# EAGLE design schematic3 (EAGLE 9.3.0)
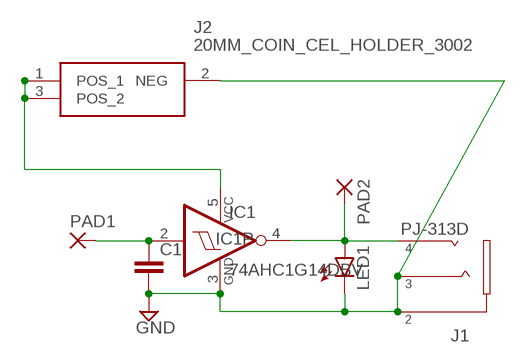
[diagram p0: schematic, sheet 1]

## Parts
C1  C-EUC0805  [C0805]
IC1  74AHC1G14DBV  [SOT23-5]
J1  PJ-313D  [PJ-313D]
J2  20MM_COIN_CEL_HOLDER_3002  [SMT_CELL_HOLDER]
LED1  LEDCHIP-LED0805  [CHIP-LED0805]
PAD1  SMD5  [SMD2,54-5,08]
PAD2  SMD5  [SMD2,54-5,08]

## Nets
GND: C1.2 IC1.3(GND) J1.2_1 J1.2_2 J1.3_1 J1.3_2 J2.2(NEG) LED1.C
N$1: C1.1 IC1.2(I) PAD1.1(P)
N$2: IC1.5(VCC) J2.1(POS_1) J2.3(POS_2)
N$3: IC1.4(O) J1.4_1 J1.4_2 LED1.A PAD2.1(P)

## Library data of the parts
C1 = rcl:C-EU: CAPACITOR, European symbol; SPICEPREFIX: C
IC1 = 74xx-little-us:74*1G14: Single Schmitt-Trigger Inverter Gate
J1 = jacks chinese:PJ-313: 3.5mm jack description Brover Geldrop MK
J2 = BatteryHolders:20MM_COIN_CEL_HOLDER_3002: SMT Holder for 20mm Cell-Tin Nickel Plate P/N 3002 Source: Datasheet <https://componentsearchengine.com/Datasheets/1/3002.pdf>; DESCRIPTION: SMT Holder for 20mm Cell-Tin Nickel Plate P/N 3002; HEIGHT: mm; MANUFACTURER_NAME: Keystone Electronics; MANUFACTURER_PART_NUMBER: 3002; MOUSER_PART_NUMBER: 534-3002; MOUSER_PRICE-STOCK: https://www.mouser.com/Search/Refine.aspx?Keyword=534-3002
LED1 = led:LED: LED OSRAM: - CHIPLED LG R971, LG N971, LY N971, LG Q971, LY Q971, LO R971, LY R971 LH N974, LH R974 LS Q976, LO Q976, LY Q976 LO Q996 - Hyper CHIPLED LW Q18S LB Q993, LB Q99A, LB R99A - SideLED LS A670, LO A670, LY A670, LG A670, LP A670 LB A673, LV A673, LT A673, LW A673 LH A674 LY A675 LS A676, LA A676, LO A676, LY A676, LW A676 LS A679, LY A679, LG A679 - Hyper Micro SIDELED® LS Y876, LA Y876, LO Y876, LY Y876 LT Y87S - SmartLED LW L88C, LW L88S LB L89C, LB L89S, LG L890 LS L89K, LO L89K, LY L89K LS L896, LA L896, LO L896, LY L896 - TOPLED LS T670, LO T670, LY T670, LG T670, LP T670 LSG T670, LSP T670, LSY T670, LOP T670, LYG T670 LG T671, LOG T671, LSG T671 LB T673, LV T673, LT T673, LW T673 LH T674 LS T676, LA T676, LO T676, LY T676, LB T676, LH T676, LSB T676, LW T676 LB T67C, LV T67C, LT T67C, LS T67K, LO T67K, LY T67K, LW E67C LS E67B, LA E67B, LO E67B, LY E67B, LB E67C, LV E67C, LT E67C LW T67C LS T679, LY T679, LG T679 LS T770, LO T770, LY T770, LG T770, LP T770 LB T773, LV T773, LT T773, LW T773 LH T774 LS E675, LA E675, LY E675, LS T675 LS T776, LA T776, LO T776, LY T776, LB T776 LHGB T686 LT T68C, LB T68C - Hyper Mini TOPLED® LB M676 - Mini TOPLED Santana® LG M470 LS M47K, LO M47K, LY M47K Source: http://www.osram.convergy.de LUXEON: - LUMILED® LXK2-PW12-R00, LXK2-PW12-S00, LXK2-PW14-U00, LXK2-PW14-V00 LXK2-PM12-R00, LXK2-PM12-S00, LXK2-PM14-U00 LXK2-PE12-Q00, LXK2-PE12-R00, LXK2-PE12-S00, LXK2-PE14-T00, LXK2-PE14-U00 LXK2-PB12-K00, LXK2-PB12-L00, LXK2-PB12-M00, LXK2-PB14-N00, LXK2-PB14-P00, LXK2-PB14-Q00 LXK2-PR12-L00, LXK2-PR12-M00, LXK2-PR14-Q00, LXK2-PR14-R00 LXK2-PD12-Q00, LXK2-PD12-R00, LXK2-PD12-S00 LXK2-PH12-R00, LXK2-PH12-S00 LXK2-PL12-P00, LXK2-PL12-Q00, LXK2-PL12-R00 Source: www.luxeon.com KINGBRIGHT: KA-3528ASYC Source: www.kingbright.com
PAD1 PAD2 = wirepad:SMD5: SMD PAD

## Board
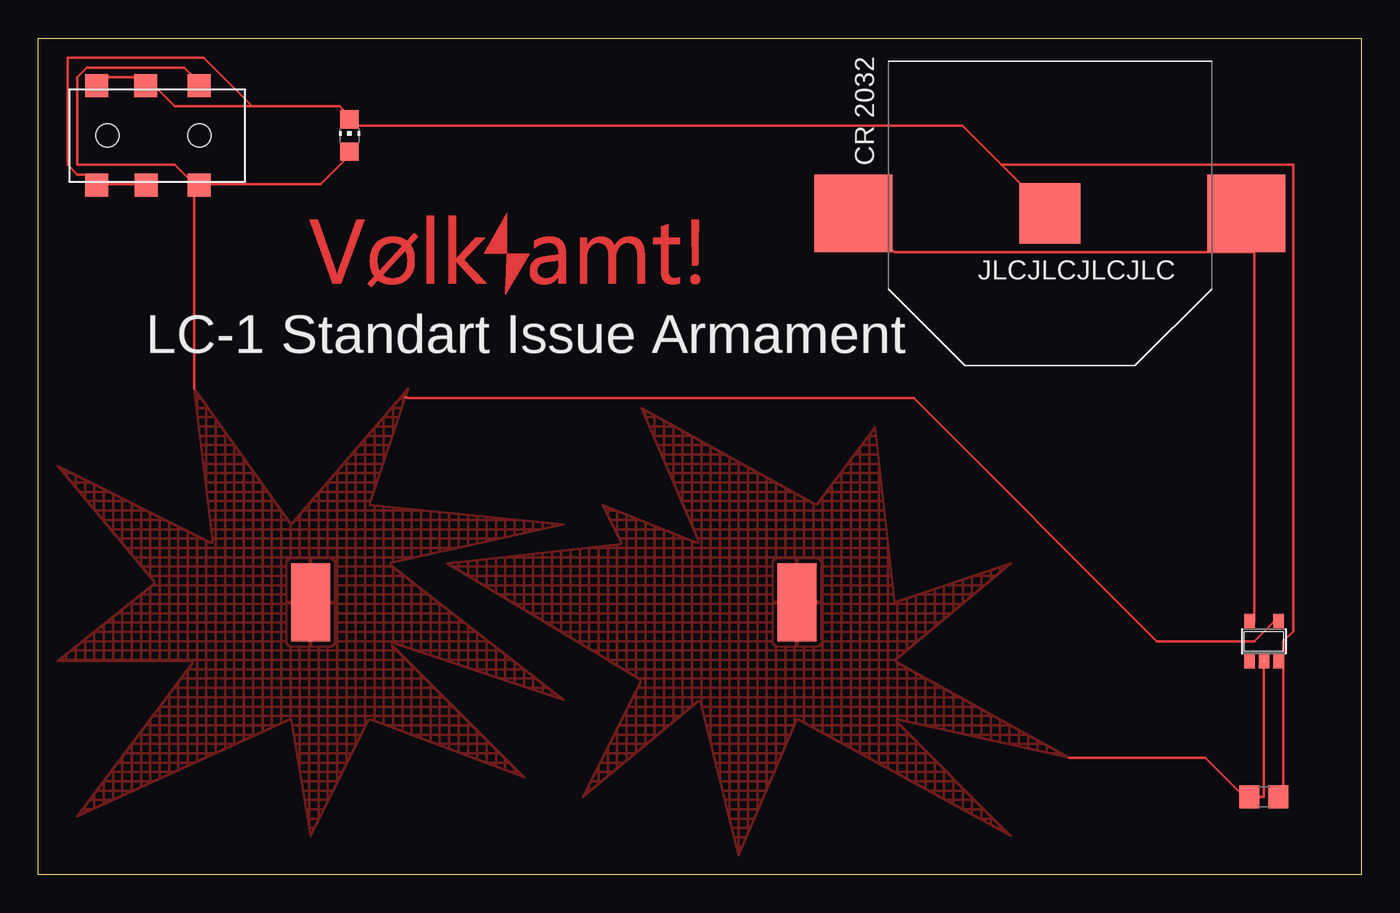
[diagram p1: board, top side]
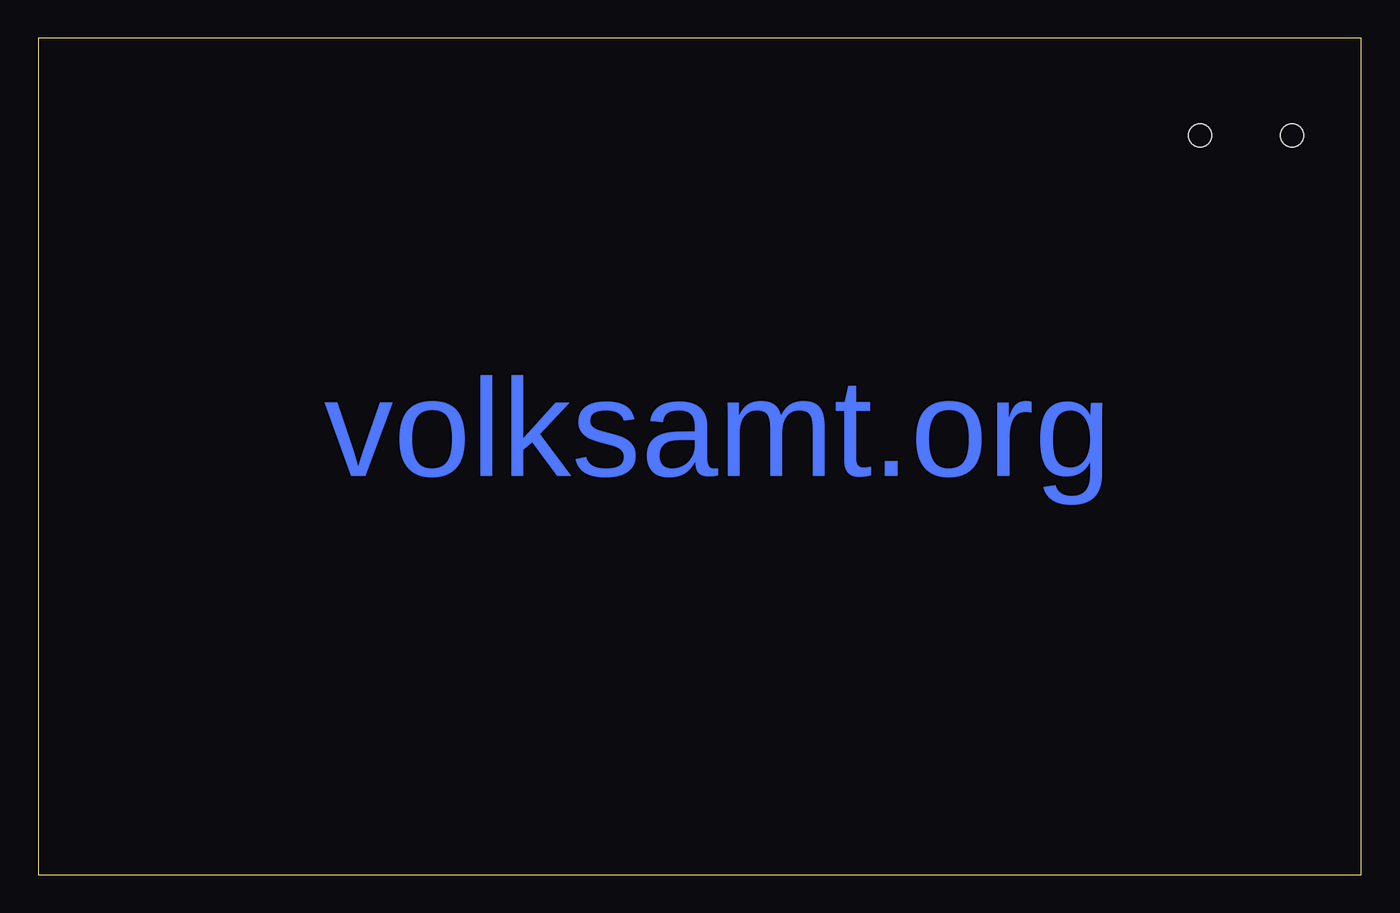
[diagram p2: board, bottom side, seen from below]

Size 86.36 x 54.61 mm. Coordinates in mm from the lower left corner, seen from the top.
Outline: 0,0 0,54.61 86.36,54.61 86.36,0 0,0
Copper layers (1*16): Top 0.035mm / dielectric 1.5mm / Bottom 0.035mm
Design rules "default": minimum track width 6mil, minimum drill 0.35mm, track to track 6mil, track to pad 6mil, pad to pad 6mil, via to via 6mil, smd to smd 6mil, copper to edge 40mil, drill to drill 6mil, minimum pad ring 10mil, minimum via ring 8mil, stop-mask expansion 4mil, vias tented up to drill 0mil, thermal gap 10mil

### Footprints (pad centres in the part's own frame; a part is rotated, then mirrored left to right if it is on the bottom)
C0805 = smd 1.3 x 1.5: 1 -0.95,0; 2 0.95,0
SOT23-5 = smd 0.69 x 0.99: 1 -0.95,-1.29; 2 0,-1.29; 3 0.95,-1.29; 4 0.95,1.3; 5 -0.95,1.3
PJ-313D = smd 1.5 x 1.5: 2_1 0,3.25; 2_2 0,-3.25; 3_1 3.2,3.25; 3_2 3.22,-3.25; 4_1 6.7,3.25; 4_2 6.7,-3.25 | hole 1.5: 0.7,0; 6.7,0
SMT_CELL_HOLDER = smd 5.08 x 5.08: 1 -12.825,0; 3 12.825,0 | smd 3.96 x 3.96: 2 0,0
CHIP-LED0805 = smd 1.2 x 1.2: A 0,-1.05; C 0,1.05
SMD2,54-5,08 = smd 2.54 x 5.08: 1 0,0

### Placement (x,y rotation side)
C1  80.01,5.08 0 top
IC1  80.01,15.24 0 top
J1  3.81,48.26 0 top
J2  66.04,43.18 0 top
LED1  20.32,48.26 0 top
PAD1  49.53,17.78 0 top
PAD2  17.78,17.78 0 top

### Tracks (layer width: path | path; a pad name or v marks a point on that pad's centre or on a via)
GND
  Top 0.152: 81.28,13.97 81.28,5.08 C1.2 | 3.81,45.09 6.99,45.09 J1.3_2 | 13.97,50.16 8.89,50.16 7.62,51.44 J1.3_1 6.99,52.07 3.81,52.07 J1.2_1 | 13.97,50.16 19.68,50.16 20.32,49.53 LED1.C 20.32,48.9 60.33,48.9 62.87,46.35 | 3.81,45.09 3.17,45.72 2.54,45.72 1.91,46.35 1.91,53.34 10.79,53.34 13.97,50.16 | 3.81,45.09 J1.2_2 | 62.87,46.35 J2.2 | 81.28,13.97 81.28,15.24 81.92,15.88 81.92,46.35 62.87,46.35 | 81.28,13.97 IC1.3
N$1
  Top 0.152: 80.01,13.97 IC1.2 80.01,5.08 C1.1 78.74,5.08 76.2,7.62 67.31,7.62
  pour Top (rank 2, hatched): 38.1,21.59 26.67,20.32 39.37,12.7 35.56,5.08 43.18,11.43 45.72,1.27 49.53,10.16 63.5,2.54 55.88,10.16 67.31,7.62 55.88,13.97 63.5,20.32 55.88,17.78 54.61,29.21 50.8,24.13 39.37,30.48 43.18,21.59 36.83,24.13
N$2
  Top 0.152: 79.38,40.64 79.38,43.18 J2.3 | 79.38,40.64 79.38,16.51 IC1.5 | 79.38,40.64 55.88,40.64 53.34,43.18 J2.1
N$3
  Top 0.152: LED1.A 20.32,46.99 18.41,45.09 10.79,45.09 J1.4_2 | J1.4_1 10.16,52.07 9.53,52.7 3.17,52.7 2.54,52.07 2.54,46.35 8.89,46.35 10.16,45.09 J1.4_2 | IC1.4 80.64,16.51 79.38,15.24 73.03,15.24 57.15,31.11 24.13,31.11 23.94,31.18 | 10.16,31.75 10.16,44.45 J1.4_2
  pour Top (hatched): 7.62,19.05 1.27,26.67 11.43,21.59 10.16,31.75 16.51,22.86 24.13,31.75 21.59,24.13 34.29,22.86 22.86,20.32 34.29,11.43 22.86,15.24 31.75,6.35 21.59,10.16 17.78,2.54 16.51,10.16 2.54,3.81 10.16,13.97 1.27,13.97
(copper drawn outside any net)
  shapes: Top area x4328

### Text on the board
Bottom: volksamt.org
tPlace: CR 2032 | JLCJLCJLCJLC | LC-1 Standart Issue Armament
bStop: volksamt.org
200bmp: C:/Users/Gokay/Desktop/Untitled-2.bmp